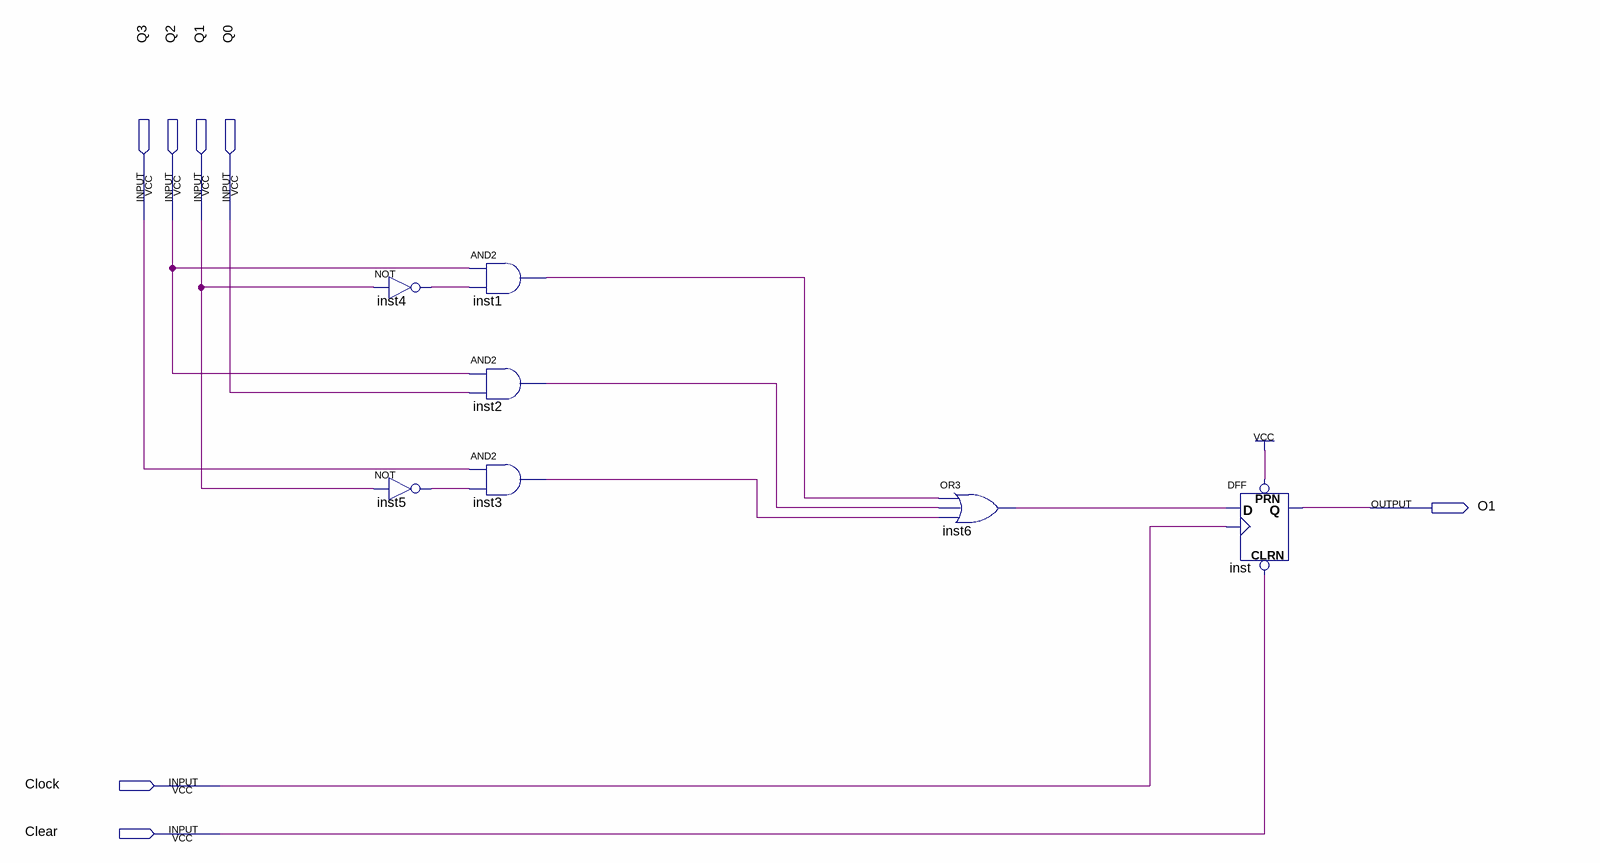
[diagram p0: schematic sheet]
// Quartus schematic D1.bdf as structural Verilog: 7 symbols, 7 pins
module D1 (
  input  Q3,
  input  Q2,
  input  Q1,
  input  Q0,
  input  Clock,
  input  Clear,
  output O1
);

  wire inst1_out, inst2_out, inst3_out, inst4_out, inst5_out, inst6_out;

  not inst4 (inst4_out, Q1);
  not inst5 (inst5_out, Q1);
  and inst1 (inst1_out, Q2, inst4_out);
  and inst2 (inst2_out, Q2, Q0);
  and inst3 (inst3_out, Q3, inst5_out);
  or inst6 (inst6_out, inst1_out, inst2_out, inst3_out);
  DFF inst (.CLRN(Clear), .CLK(Clock), .D(inst6_out), .PRN(1'b1), .Q(O1));
endmodule
